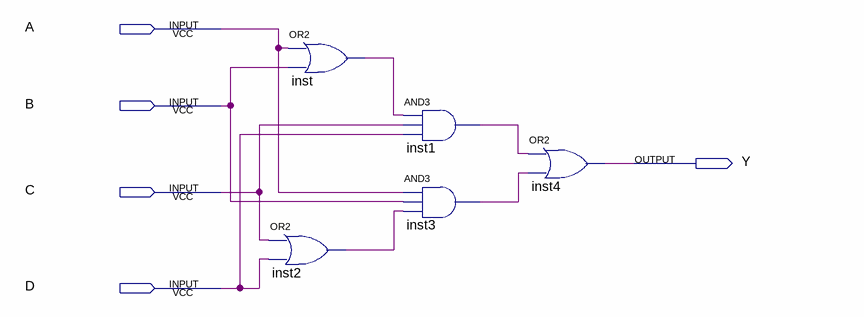
[diagram p0: schematic sheet]
// Quartus schematic prac1.bdf as structural Verilog: 5 symbols, 5 pins
module prac1 (
  input  A,
  input  B,
  input  C,
  input  D,
  output Y
);

  wire inst1_out, inst2_out, inst3_out, inst_out;

  or inst (inst_out, A, B);
  or inst2 (inst2_out, C, D);
  and inst1 (inst1_out, inst_out, C, D);
  and inst3 (inst3_out, A, B, inst2_out);
  or inst4 (Y, inst1_out, inst3_out);
endmodule
